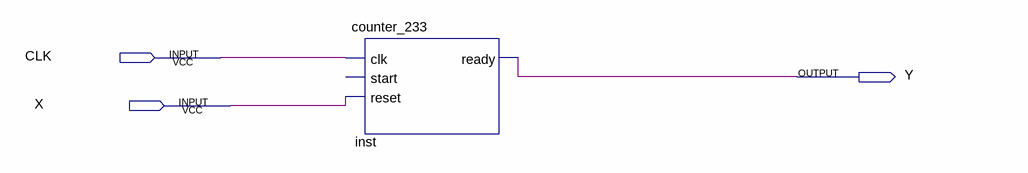
[diagram p0: schematic sheet]
// Quartus schematic TopLevel.bdf as structural Verilog: 1 symbols, 3 pins
module TopLevel (
  input  CLK,
  input  X,
  output Y
);

  counter_233 inst (.clk(CLK), .reset(X), .ready(Y));  // open: start
endmodule
